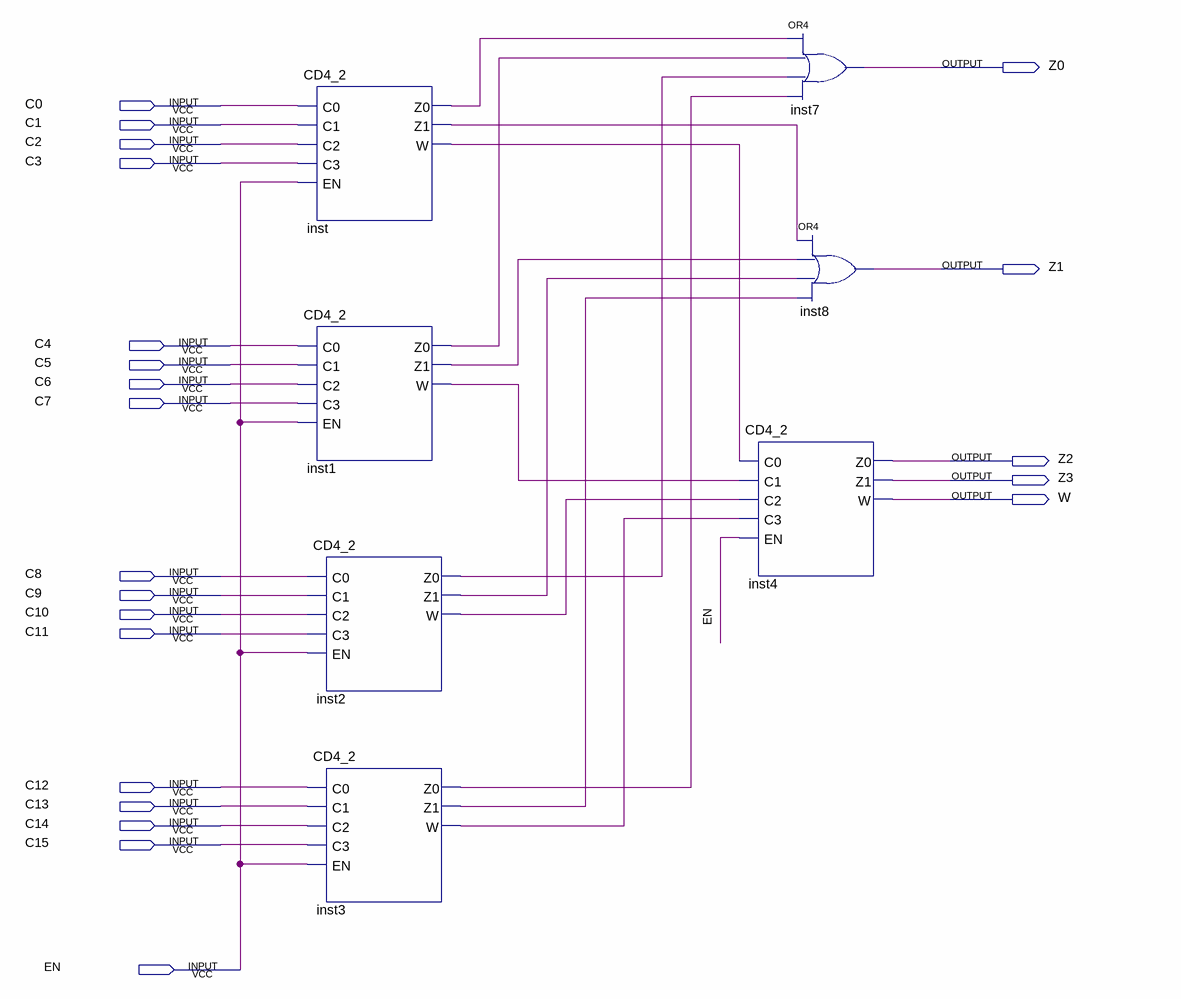
[diagram p0: schematic sheet]
// Quartus schematic CD16_4.bdf as structural Verilog: 7 symbols, 22 pins
module CD16_4 (
  input  C0,
  input  C1,
  input  C2,
  input  C3,
  input  C4,
  input  C5,
  input  C6,
  input  C7,
  input  C8,
  input  C9,
  input  C10,
  input  C11,
  input  C12,
  input  C13,
  input  C14,
  input  C15,
  input  EN,
  output Z0,
  output Z1,
  output Z2,
  output Z3,
  output W
);

  wire inst1_w, inst1_z0, inst1_z1, inst2_w, inst2_z0, inst2_z1, inst3_w, inst3_z0, inst3_z1, inst_w,
       inst_z0, inst_z1;

  CD4_2 inst (.C0(C0), .C1(C1), .C2(C2), .C3(C3), .EN(EN), .Z0(inst_z0), .Z1(inst_z1), .W(inst_w));
  CD4_2 inst1 (.C0(C4), .C1(C5), .C2(C6), .C3(C7), .EN(EN), .Z0(inst1_z0), .Z1(inst1_z1), .W(inst1_w));
  CD4_2 inst2 (.C0(C8), .C1(C9), .C2(C10), .C3(C11), .EN(EN), .Z0(inst2_z0), .Z1(inst2_z1), .W(inst2_w));
  CD4_2 inst3 (.C0(C12), .C1(C13), .C2(C14), .C3(C15), .EN(EN), .Z0(inst3_z0), .Z1(inst3_z1), .W(inst3_w));
  CD4_2 inst4 (.C0(inst_w), .C1(inst1_w), .C2(inst2_w), .C3(inst3_w), .EN(EN), .Z0(Z2), .Z1(Z3), .W(W));
  or inst7 (Z0, inst_z0, inst1_z0, inst2_z0, inst3_z0);
  or inst8 (Z1, inst_z1, inst1_z1, inst2_z1, inst3_z1);
endmodule
